# Altium project S6D01D4NucleoExtensionBoard.PrjPcb
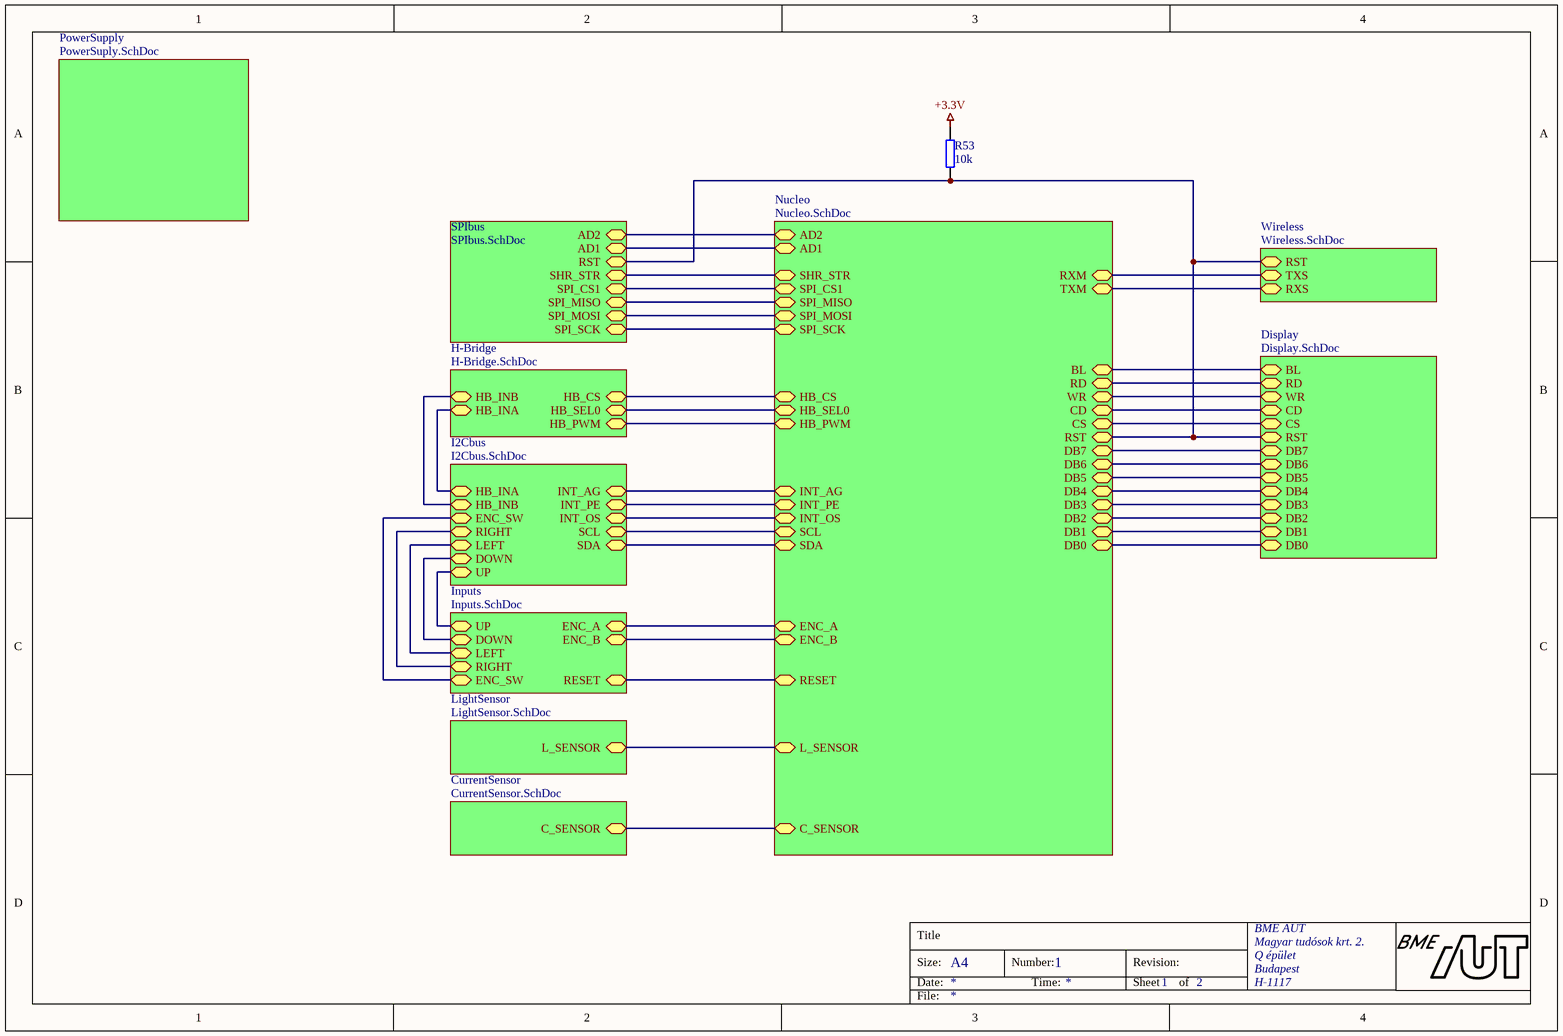
[diagram p0: S6D01D4NucleoExtensionBoard.SchDoc]
5 sheets, 55 parts. Net scope: hierarchical (ports join the sheet entries above them; power ports are global).
Board files: S6D01D4NucleoExtensionBoard1_values.PcbDoc, S6D01D4NucleoExtensionBoard1.PcbDoc
Sheets:
  S6D01D4NucleoExtensionBoard.SchDoc
    Display = Display.SchDoc
    SPIbus = SPIbus.SchDoc
    PowerSupply = PowerSuply.SchDoc
    CurrentSensor = CurrentSensor.SchDoc

## Sheet S6D01D4NucleoExtensionBoard.SchDoc
size A4; Organization: BME AUT; Address1: Magyar tudósok krt. 2.; Address2: Q épület; Address3: Budapest; Address4: H-1117; DocumentNumber: 1; SheetNumber: 1; SheetTotal: 2

### Parts
R53  10k  [RES 0805]

### Sub-sheets
CurrentSensor = CurrentSensor.SchDoc: C_SENSOR (bidir)
Display = Display.SchDoc: DB1 (bidir), DB2 (bidir), DB0 (bidir), DB3 (bidir), DB4 (bidir), DB5 (bidir), DB6 (bidir), WR (bidir), CD (bidir), DB7 (bidir), RD (bidir), CS (bidir), RST (bidir), BL (bidir)
H-Bridge = H-Bridge.SchDoc (file not in this document): HB_CS (bidir), HB_SEL0 (bidir), HB_INB (bidir), HB_PWM (bidir), HB_INA (bidir)
I2Cbus = I2Cbus.SchDoc (file not in this document): LEFT (bidir), INT_PE (bidir), SDA (bidir), DOWN (bidir), SCL (bidir), RIGHT (bidir), ENC_SW (bidir), INT_AG (bidir), UP (bidir), INT_OS (bidir), HB_INA (bidir), HB_INB (bidir)
Inputs = Inputs.SchDoc (file not in this document): UP (bidir), ENC_SW (bidir), ENC_A (bidir), LEFT (bidir), DOWN (bidir), ENC_B (bidir), RIGHT (bidir), RESET (bidir)
LightSensor = LightSensor.SchDoc (file not in this document): L_SENSOR (bidir)
Nucleo = Nucleo.SchDoc (file not in this document): DB1 (bidir), DB2 (bidir), DB4 (bidir), DB0 (bidir), DB3 (bidir), DB5 (bidir), DB6 (bidir), WR (bidir), CD (bidir), DB7 (bidir), RD (bidir), CS (bidir), RST (bidir), BL (bidir), RXM (bidir), TXM (bidir), SPI_MOSI (bidir), SPI_SCK (bidir), SPI_CS1 (bidir), SPI_MISO (bidir), SHR_STR (bidir), SDA (bidir), SCL (bidir), RESET (bidir), ENC_A (bidir), ENC_B (bidir), INT_PE (bidir), INT_OS (bidir), INT_AG (bidir), HB_SEL0 (bidir), HB_CS (bidir), HB_PWM (bidir), L_SENSOR (bidir), AD1 (bidir), AD2 (bidir), C_SENSOR (bidir)
PowerSupply = PowerSuply.SchDoc: no entries
SPIbus = SPIbus.SchDoc: SPI_CS1 (bidir), SPI_SCK (bidir), SPI_MOSI (bidir), SHR_STR (bidir), SPI_MISO (bidir), RST (bidir), AD2 (bidir), AD1 (bidir)
Wireless = Wireless.SchDoc (file not in this document): RXS (bidir), TXS (bidir), RST (bidir)

### Nets
+3.3V: R53.2
AD1: sheet Nucleo/AD1, sheet SPIbus/AD1
AD2: sheet Nucleo/AD2, sheet SPIbus/AD2
BL: sheet Display/BL, sheet Nucleo/BL
C_SENSOR: sheet Nucleo/C_SENSOR, sheet CurrentSensor/C_SENSOR
CD: sheet Display/CD, sheet Nucleo/CD
CS: sheet Display/CS, sheet Nucleo/CS
DB0: sheet Display/DB0, sheet Nucleo/DB0
DB1: sheet Display/DB1, sheet Nucleo/DB1
DB2: sheet Display/DB2, sheet Nucleo/DB2
DB3: sheet Display/DB3, sheet Nucleo/DB3
DB4: sheet Display/DB4, sheet Nucleo/DB4
DB5: sheet Display/DB5, sheet Nucleo/DB5
DB6: sheet Display/DB6, sheet Nucleo/DB6
DB7: sheet Display/DB7, sheet Nucleo/DB7
RD: sheet Display/RD, sheet Nucleo/RD
RST: R53.1 ; sheet Display/RST, sheet Nucleo/RST, sheet Wireless/RST, sheet SPIbus/RST
SHR_STR: sheet Nucleo/SHR_STR, sheet SPIbus/SHR_STR
SPI_CS1: sheet Nucleo/SPI_CS1, sheet SPIbus/SPI_CS1
SPI_MISO: sheet Nucleo/SPI_MISO, sheet SPIbus/SPI_MISO
SPI_MOSI: sheet Nucleo/SPI_MOSI, sheet SPIbus/SPI_MOSI
SPI_SCK: sheet Nucleo/SPI_SCK, sheet SPIbus/SPI_SCK
WR: sheet Display/WR, sheet Nucleo/WR
(unnamed): sheet Nucleo/RXM, sheet Wireless/TXS
(unnamed): sheet Nucleo/TXM, sheet Wireless/RXS
(unnamed): sheet Nucleo/SDA, sheet I2Cbus/SDA
(unnamed): sheet Nucleo/SCL, sheet I2Cbus/SCL
(unnamed): sheet Nucleo/RESET, sheet Inputs/RESET
(unnamed): sheet Nucleo/ENC_A, sheet Inputs/ENC_A
(unnamed): sheet Nucleo/ENC_B, sheet Inputs/ENC_B
(unnamed): sheet Nucleo/INT_PE, sheet I2Cbus/INT_PE
(unnamed): sheet Nucleo/INT_OS, sheet I2Cbus/INT_OS
(unnamed): sheet Nucleo/INT_AG, sheet I2Cbus/INT_AG
(unnamed): sheet Nucleo/HB_SEL0, sheet H-Bridge/HB_SEL0
(unnamed): sheet Nucleo/HB_CS, sheet H-Bridge/HB_CS
(unnamed): sheet Nucleo/HB_PWM, sheet H-Bridge/HB_PWM
(unnamed): sheet Nucleo/L_SENSOR, sheet LightSensor/L_SENSOR
(unnamed): sheet I2Cbus/LEFT, sheet Inputs/LEFT
(unnamed): sheet I2Cbus/DOWN, sheet Inputs/DOWN
(unnamed): sheet I2Cbus/RIGHT, sheet Inputs/RIGHT
(unnamed): sheet I2Cbus/ENC_SW, sheet Inputs/ENC_SW
(unnamed): sheet I2Cbus/UP, sheet Inputs/UP
(unnamed): sheet I2Cbus/HB_INA, sheet H-Bridge/HB_INA
(unnamed): sheet I2Cbus/HB_INB, sheet H-Bridge/HB_INB

### Notes on the sheet
- Title
- Size:
- Date:
- A4
- Number:
- Time:
- Revision:
- Sheet
- of
- File:

### Library data of the parts
R53 = RES: RESISTOR; REFERENCE ID: *; DISTRIBUTOR: *; VALUE: 10k

## Sheet Display.SchDoc
size A4
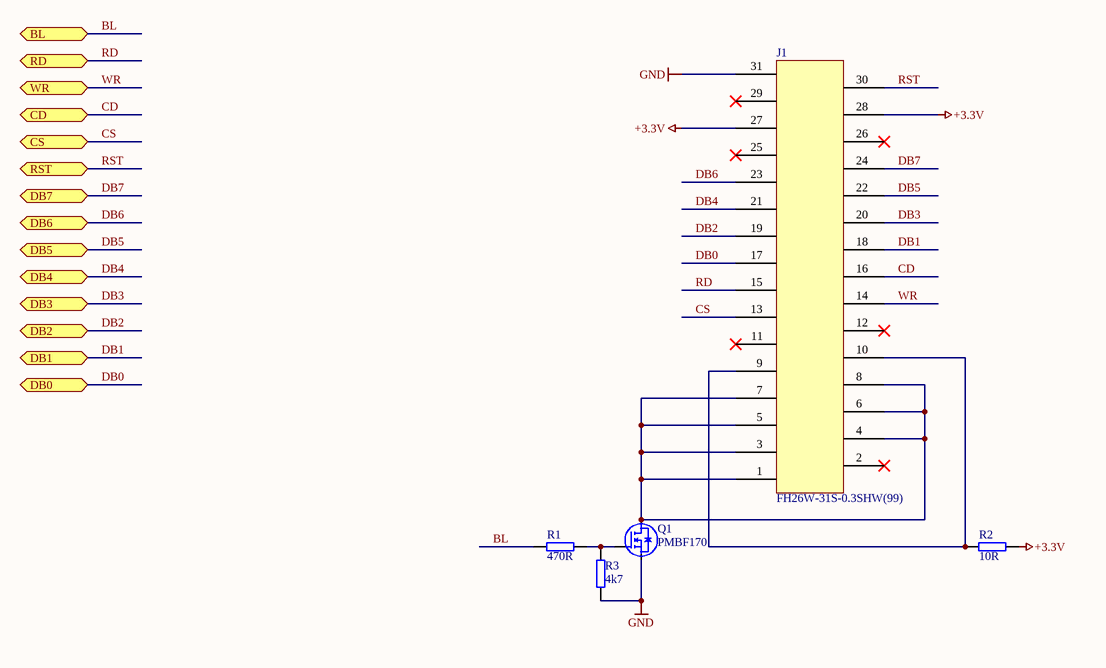
[diagram p1: Display.SchDoc]

### Parts
J1  FH26W-31S-0.3SHW(99)  [FH26W-31S-0.3SHW(99)]
Q1  PMBF170  [SOT23]
R1  470R  [RES 0805]
R2  10R  [RES 0805]
R3  4k7  [RES 0805]

### Ports
BL (bidir), CD (bidir), CS (bidir), DB0 (bidir), DB1 (bidir), DB2 (bidir), DB3 (bidir), DB4 (bidir), DB5 (bidir), DB6 (bidir), DB7 (bidir), RD (bidir), RST (bidir), WR (bidir)

### Nets
+3.3V: J1.27 J1.28 R2.1
GND: J1.31 Q1.2(S) R3.1
BL: R1.1 ; port BL
CD: J1.16 ; port CD
CS: J1.13 ; port CS
DB0: J1.17 ; port DB0
DB1: J1.18 ; port DB1
DB2: J1.19 ; port DB2
DB3: J1.20 ; port DB3
DB4: J1.21 ; port DB4
DB5: J1.22 ; port DB5
DB6: J1.23 ; port DB6
DB7: J1.24 ; port DB7
RD: J1.15 ; port RD
RST: J1.30 ; port RST
WR: J1.14 ; port WR
NetJ1_1: J1.1 J1.3 J1.4 J1.5 J1.6 J1.7 J1.8 Q1.3(D)
NetJ1_9: J1.9 J1.10 R2.2
NetQ1_1: Q1.1(G) R1.2 R3.2

Not connected (* = marked no-connect by the designer): J1 2* 11* 12* 25* 26* 29*

### Library data of the parts
J1 = FH26W-31S-0.3SHW(99): Hirose FH26 0.3mm Pitch 31 Way Right Angle SMT Female FPC Connector, ZIF Bottom Contact; RS Components: 738-8877; Manufacturer: Hirose; Name: FH26W-31S-0.3SHW(99)
Q1 = PMBF170: N-Channel MOSFET; Name: PMBF170; Datasheet: https://assets.nexperia.com/documents/data-sheet/PMBF170.pdf
R1-R3 = RES: RESISTOR
  R1: REFERENCE ID: *; DISTRIBUTOR: *; VALUE: 470R
  R2: Reference: 81-10-83; Supplier: LOMEX; VALUE: 10R
  R3: REFERENCE ID: *; DISTRIBUTOR: *; VALUE: 4k7

## Sheet SPIbus.SchDoc
size A4
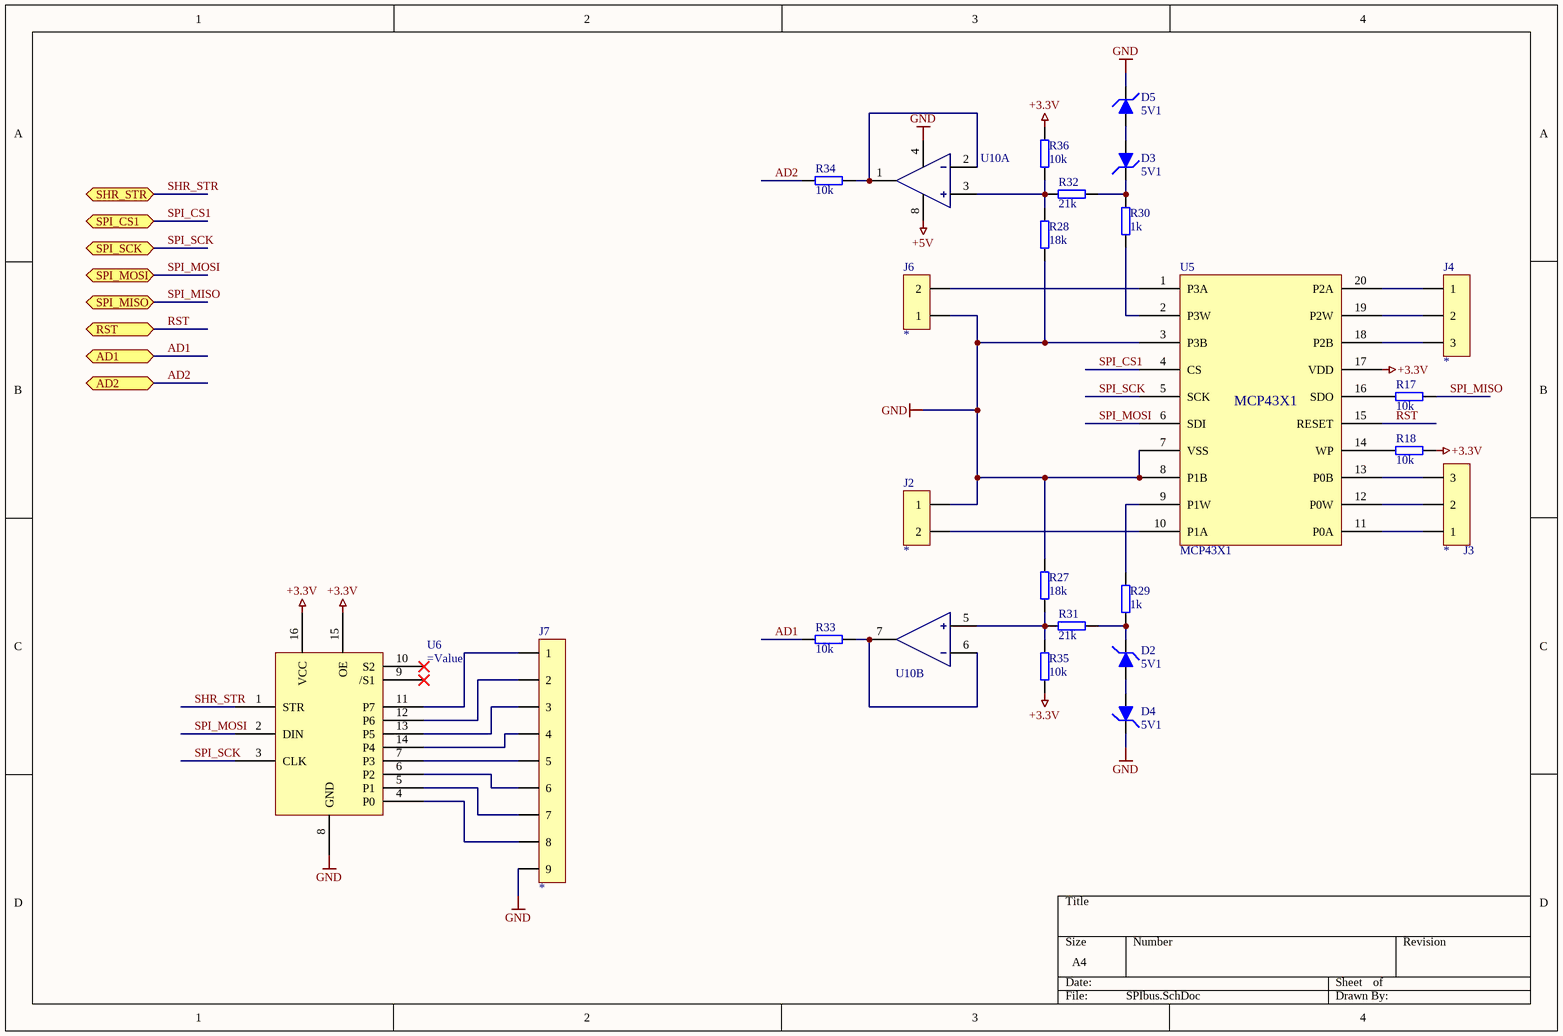
[diagram p2: SPIbus.SchDoc]

### Parts
D2  U_Z: 5V1  [SOD-232F]
D3  U_Z: 5V1  [SOD-232F]
D4  U_Z: 5V1  [SOD-232F]
D5  U_Z: 5V1  [SOD-232F]
J2  *  [SIL2]
J3  *  [SIL3]
J4  *  [SIL3]
J6  *  [SIL2]
J7  *  [SIL9]
R17  10k  [RES 0805]
R18  10k  [RES 0805]
R27  18k  [RES 0805]
R28  18k  [RES 0805]
R29  1k  [RES 0805]
R30  1k  [RES 0805]
R31  21k  [RES 0805]
R32  21k  [RES 0805]
R33  10k  [RES 0805]
R34  10k  [RES 0805]
R35  10k  [RES 0805]
R36  10k  [RES 0805]
U5  MCP43X1  [TSSOP20]
U6  (no value)  [SO16N]
U10  TL082  [SO8]  (value not drawn)  (parts A,B of 2)

### Ports
AD1 (bidir), AD2 (bidir), RST (bidir), SHR_STR (bidir), SPI_CS1 (bidir), SPI_MISO (bidir), SPI_MOSI (bidir), SPI_SCK (bidir)

### Nets
+3.3V: R18.2 R35.2 R36.2 U5.17(VDD) U6.15(OE) U6.16(VCC)
+5V: U10.8(VCC)
GND: D4.2(K) D5.2(K) J2.1 J6.1 J7.9 R27.1 R28.1 U5.3(P3B) U5.7(VSS) U5.8(P1B) U6.8(GND) U10.4(GND)
AD1: R33.2 ; port AD1
AD2: R34.2 ; port AD2
RST: U5.15(RESET) ; port RST
SHR_STR: U6.1(STR) ; port SHR_STR
SPI_CS1: U5.4(CS) ; port SPI_CS1
SPI_MISO: R17.2 ; port SPI_MISO
SPI_MOSI: U5.6(SDI) U6.2(DIN) ; port SPI_MOSI
SPI_SCK: U5.5(SCK) U6.3(CLK) ; port SPI_SCK
NetD2_1: D2.1(A) D4.1(A)
NetD2_2: D2.2(K) R29.1 R31.2
NetD3_1: D3.1(A) D5.1(A)
NetD3_2: D3.2(K) R30.1 R32.2
NetJ2_2: J2.2 U5.10(P1A)
NetJ3_1: J3.1 U5.11(P0A)
NetJ3_2: J3.2 U5.12(P0W)
NetJ3_3: J3.3 U5.13(P0B)
NetJ4_1: J4.1 U5.20(P2A)
NetJ4_2: J4.2 U5.19(P2W)
NetJ4_3: J4.3 U5.18(P2B)
NetJ6_2: J6.2 U5.1(P3A)
NetJ7_1: J7.1 U6.11(P7)
NetJ7_2: J7.2 U6.12(P6)
NetJ7_3: J7.3 U6.13(P5)
NetJ7_4: J7.4 U6.14(P4)
NetJ7_5: J7.5 U6.7(P3)
NetJ7_6: J7.6 U6.6(P2)
NetJ7_7: J7.7 U6.5(P1)
NetJ7_8: J7.8 U6.4(P0)
NetR17_1: R17.1 U5.16(SDO)
NetR18_1: R18.1 U5.14(WP)
NetR27_2: R27.2 R31.1 R35.1 U10.5(+)
NetR28_2: R28.2 R32.1 R36.1 U10.3(+)
NetR29_2: R29.2 U5.9(P1W)
NetR30_2: R30.2 U5.2(P3W)
NetR33_1: R33.1 U10.6(-) U10.7(OUT)
NetR34_1: R34.1 U10.1(OUT) U10.2(-)

Not connected (* = marked no-connect by the designer): U6 9(/S1)* 10(S2)*

### Library data of the parts
D2-D5 = ZENER: Zener Diode
J2 J6 = HEADER2: 2 PIN HEADER; REFERENCE ID: *; DISTRIBUTOR: *; VALUE: *
J3 J4 = HEADER3: 3 PIN HEADER; Value: *
J7 = HEADER9: 9 PIN HEADER; Value: *
R17 R18 R27-R36 = RES: RESISTOR; REFERENCE ID: *; DISTRIBUTOR: *
  R17 R18 R33-R36: VALUE: 10k
  R27 R28: VALUE: 18k
  R29 R30: VALUE: 1k
  R31 R32: VALUE: 21k
U5 = MCP43X1: SPI INTERFACE QUAD DIGITAL POTENTIOMETERS; Name: MCP43X1; Datasheet: http://ww1.microchip.com/downloads/en/DeviceDoc/22242A.pdf
U6 = 4094: 8 BIT SHIFT REGISTER; Name: 4094; Datasheet: https://assets.nexperia.com/documents/data-sheet/74HC_HCT4094.pdf
U10 = TL082: OPAMP, SO8; Name: TL082; Datasheet: http://www.ti.com/lit/ds/symlink/tl082.pdf

## Sheet PowerSuply.SchDoc
size A4
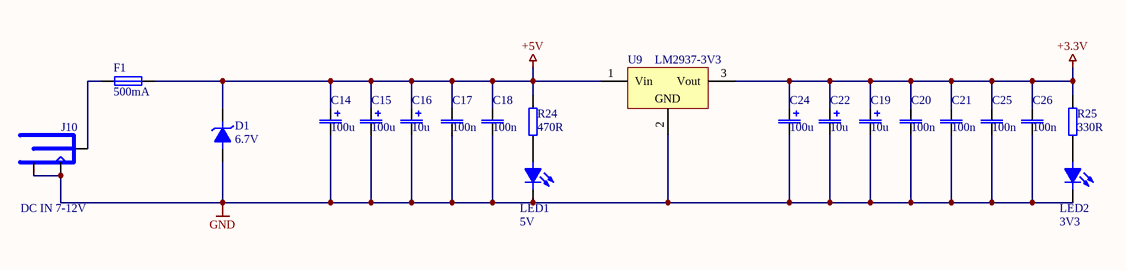
[diagram p3: PowerSuply.SchDoc]

### Parts
C14  100u  [D8 ELKO]
C15  100u  [D8 ELKO]
C16  10u  [CAP 1210]
C17  100n  [CAP 0805]
C18  100n  [CAP 0805]
C19  10u  [CAP 1210]
C20  100n  [CAP 0805]
C21  100n  [CAP 0805]
C22  10u  [CAP 1210]
C24  100u  [D8 ELKO]
C25  100n  [CAP 0805]
C26  100n  [CAP 0805]
D1  6.7V  [SMA]
F1  500mA  [FUSE1812]
J10  DC IN 7-12V  [DC POWER CONNECTOR]
LED1  5V  [LED 0805G]
LED2  3V3  [LED 0805G]
R24  470R  [RES 0805]
R25  330R  [RES 0805]
U9  LM2937-3V3  [SOT223]

### Nets
+3.3V: C19.1(+) C20.2 C21.2 C22.1(+) C24.1(+) C25.2 C26.2 R25.2 U9.3(Vout)
+5V: C14.1(+) C15.1(+) C16.1(+) C17.2 C18.2 D1.2(K) F1.2 R24.2 U9.1(Vin)
GND: C14.2(-) C15.2(-) C16.2(-) C17.1 C18.1 C19.2(-) C20.1 C21.1 C22.2(-) C24.2(-) C25.1 C26.1 D1.1(A) J10.2(GND) J10.3(GND) LED1.2(K) LED2.2(K) U9.2(GND)
NetF1_1: F1.1 J10.1(9V)
NetLED1_1: LED1.1(A) R24.1
NetLED2_1: LED2.1(A) R25.1

### Library data of the parts
C14-C16 C19 C22 C24 = CAP_POL: POLARIZED CAPACITOR; Supplier: LOMEX
  C14 C15 C24: Reference: 91-00-90; VALUE: 100u
  C16 C19 C22: Reference: 92-01-13; VALUE: 10u
C17 C18 C20 C21 C25 C26 = CAP: NON POLARIZED CAPACITOR; VALUE: 100n; Reference: 82-01-25; Supplier: LOMEX
D1 = SUPRESSOR DIODE: Reference: 96-00-75; VALUE: 6.7V; Supplier: LOMEX
F1 = FUSE: Reference: 44-02-32; VALUE: 500mA; Supplier: LOMEX
J10 = DC POWER CONN: DC POWER CONNECTOR 5.5/2.1/9.5mm; Supplier: LOMEX; Reference: 43-07-67; VALUE: DC IN 7-12V
LED1 LED2 = LED: Reference: 95-01-09; Supplier: LOMEX
  LED1: VALUE: 5V
  LED2: VALUE: 3V3
R24 R25 = RES: RESISTOR; Reference: 81-10-83; Supplier: LOMEX
  R24: VALUE: 470R
  R25: VALUE: 330R
U9 = LM2937: SOT223; Name: LM2937-3V3; Datasheet: http://www.ti.com/lit/ds/symlink/lm2937.pdf

## Sheet CurrentSensor.SchDoc
size A4
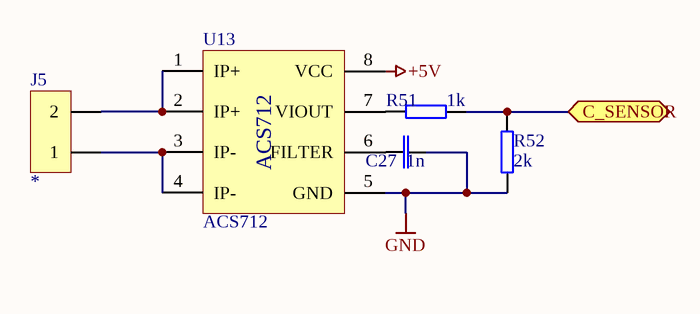
[diagram p4: CurrentSensor.SchDoc]

### Parts
C27  1n  [CAP 0805]
J5  *  [PTR_AKZ350]
R51  1k  [RES 0805]
R52  2k  [RES 0805]
U13  ACS712  [SO8]

### Ports
C_SENSOR (bidir)

### Nets
+5V: U13.8(VCC)
GND: C27.1 R52.1 U13.5(GND)
C_SENSOR: R51.1 R52.2 ; port C_SENSOR
NetC27_2: C27.2 U13.6(FILTER)
NetJ5_1: J5.1 U13.3(IP-) U13.4(IP-)
NetJ5_2: J5.2 U13.1(IP+) U13.2(IP+)
NetR51_2: R51.2 U13.7(VIOUT)

### Library data of the parts
C27 = CAP: NON POLARIZED CAPACITOR; VALUE: 1n; Reference: 82-01-25; Supplier: LOMEX
J5 = HEADER2: 2 PIN HEADER; REFERENCE ID: *; DISTRIBUTOR: *; VALUE: *
R51 R52 = RES: RESISTOR; Reference: 81-10-83; Supplier: LOMEX
  R51: VALUE: 1k
  R52: VALUE: 2k
U13 = ACS712: Current sensor IC; Name: ACS712; Datasheet: https://www.sparkfun.com/datasheets/BreakoutBoards/0712.pdf

## Nets that join several sheets
+3.3V: S6D01D4NucleoExtensionBoard (R53.2), Display (J1.27 J1.28 R2.1), SPIbus (6 pins), PowerSuply (9 pins)
+5V: SPIbus (U10.8), PowerSuply (9 pins), CurrentSensor (U13.8)
GND: Display (J1.31 Q1.2 R3.1), SPIbus (12 pins), PowerSuply (18 pins), CurrentSensor (C27.1 R52.1 U13.5)
RST: S6D01D4NucleoExtensionBoard (R53.1), Display (J1.30), SPIbus (U5.15)